# EAGLE design Drummer_Project (EAGLE 9.6.2)
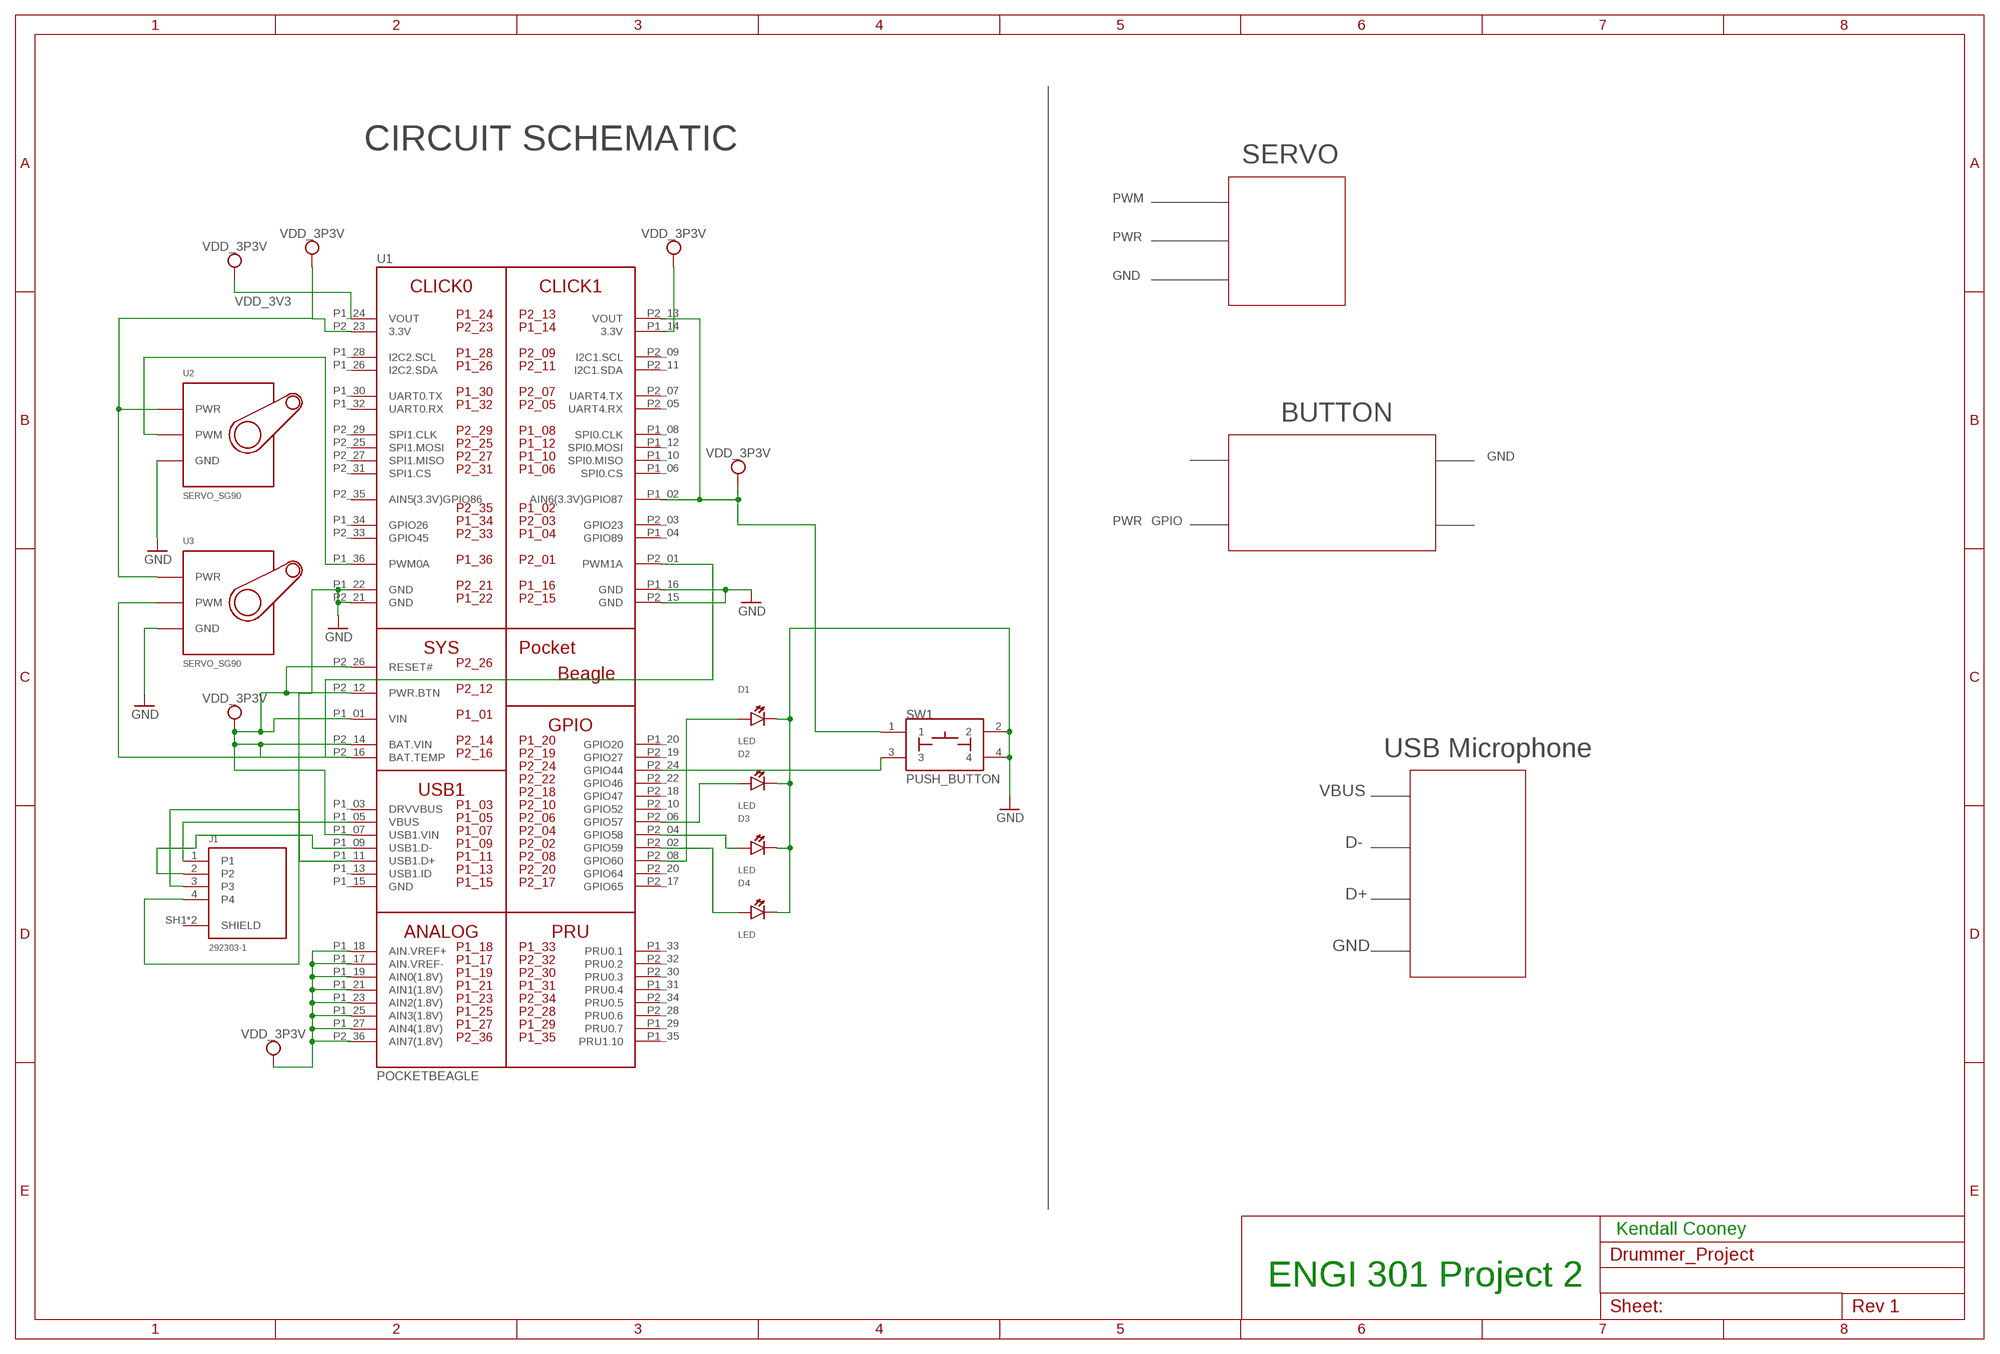
[diagram p0: schematic, sheet 1]

## Parts
D1  LED  [EIA-STD]
D2  LED  [EIA-STD]
D3  LED  [EIA-STD]
D4  LED  [EIA-STD]
J1  292303-1  [TE_292303-1]
SW1  PUSH_BUTTON  [BUTTON_12.5MM]
U1  POCKETBEAGLE  [POCKETBEAGLE]
U2  SERVO_SG90  [SERVO-X1]
U3  SERVO_SG90  [SERVO-X1]

## Nets
GND: D1.CATHODE D2.CATHODE D3.CATHODE D4.CATHODE J1.4 SW1.2 SW1.4 U1.P1_16(GND) U1.P1_22(GND) U1.P2_15(GND) U1.P2_21(GND) U2.GND U3.GND
N$1: SW1.3 U1.P2_24(GPIO44)
N$2: D4.ANODE U1.P2_02(GPIO59)
N$3: D3.ANODE U1.P2_04(GPIO58)
N$4: D1.ANODE U1.P2_08(GPIO60)
N$5: D2.ANODE U1.P2_06(GPIO57)
N$8: U1.P1_36(PWM0A) U2.SIG(PWM)
N$10: U1.P2_01(PWM1A) U3.SIG(PWM)
N$11: J1.1 U1.P1_05(VBUS)
N$12: J1.2 U1.P1_09(USB1.D-)
N$13: J1.3 U1.P1_11(USB1.D+)
VDD_3V3: SW1.1 U1.P1_01(VIN) U1.P1_02(AIN6(3.3V)GPIO87) U1.P1_07(USB1.VIN) U1.P1_14(3.3V) U1.P1_17(AIN.VREF-) U1.P1_18(AIN.VREF+) U1.P1_19(AIN0(1.8V)) U1.P1_21(AIN1(1.8V)) U1.P1_23(AIN2(1.8V)) U1.P1_24(VOUT) U1.P1_25(AIN3(1.8V)) U1.P1_27(AIN4(1.8V)) U1.P2_12(PWR.BTN) U1.P2_13(VOUT) U1.P2_14(BAT.VIN) U1.P2_16(BAT.TEMP) U1.P2_23(3.3V) U1.P2_26(RESET#) U1.P2_36(AIN7(1.8V)) U2.PWR U3.PWR ; supply symbol labelled VDD_3P3V
Unconnected: J1.SH1(SHIELD) J1.SH2(SHIELD) U1.P1_03(DRVVBUS) U1.P1_04(GPIO89) U1.P1_06(SPI0.CS) U1.P1_08(SPI0.CLK) U1.P1_10(SPI0.MISO) U1.P1_12(SPI0.MOSI) U1.P1_13(USB1.ID) U1.P1_15(GND) U1.P1_20(GPIO20) U1.P1_26(I2C2.SDA) U1.P1_28(I2C2.SCL) U1.P1_29(PRU0.7) U1.P1_30(UART0.TX) U1.P1_31(PRU0.4) U1.P1_32(UART0.RX) U1.P1_33(PRU0.1) U1.P1_34(GPIO26) U1.P1_35(PRU1.10) U1.P2_03(GPIO23) U1.P2_05(UART4.RX) U1.P2_07(UART4.TX) U1.P2_09(I2C1.SCL) U1.P2_10(GPIO52) U1.P2_11(I2C1.SDA) U1.P2_17(GPIO65) U1.P2_18(GPIO47) U1.P2_19(GPIO27) U1.P2_20(GPIO64) U1.P2_22(GPIO46) U1.P2_25(SPI1.MOSI) U1.P2_27(SPI1.MISO) U1.P2_28(PRU0.6) U1.P2_29(SPI1.CLK) U1.P2_30(PRU0.3) U1.P2_31(SPI1.CS) U1.P2_32(PRU0.2) U1.P2_33(GPIO45) U1.P2_34(PRU0.5) U1.P2_35(AIN5(3.3V)GPIO86)

## Notes on the sheet
- CIRCUIT SCHEMATIC
- SERVO
- PWM
- PWR
- GND
- BUTTON
- GND
- PWR | GPIO
- USB Microphone
- VBUS
- D-
- D+
- GND
- Kendall Cooney
- ENGI 301 Project 2

## Library data of the parts
D1-D4 = combo_lock:LED: EIA-STD LED, LTST-C191TBKT
J1 = 292303-1:292303-1: CONN USB RECEPT R/A TYPE A 4POS Check availability <https://pricing.snapeda.com/parts/292303-1/TE%20Connectivity/view-part?ref=eda>; AVAILABILITY: In Stock; COMMENT: 292303-1; DESCRIPTION: Conn; Data; USB; Recept; 2.0; 4 Pos; 1 Port; Rt Angle; A Ser; Tin over Copper; EU_ROHS_COMPLIANCE: Compliant; MF: TE Connectivity; MP: 292303-1; PACKAGE: None; PRICE: None; PURCHASE-URL: https://pricing.snapeda.com/search/part/292303-1/?ref=eda
SW1 = combo_lock:PUSH_BUTTON
U1 = combo_lock:POCKETBEAGLE
U2 U3 = combo_lock:SERVO_SG90

## Board
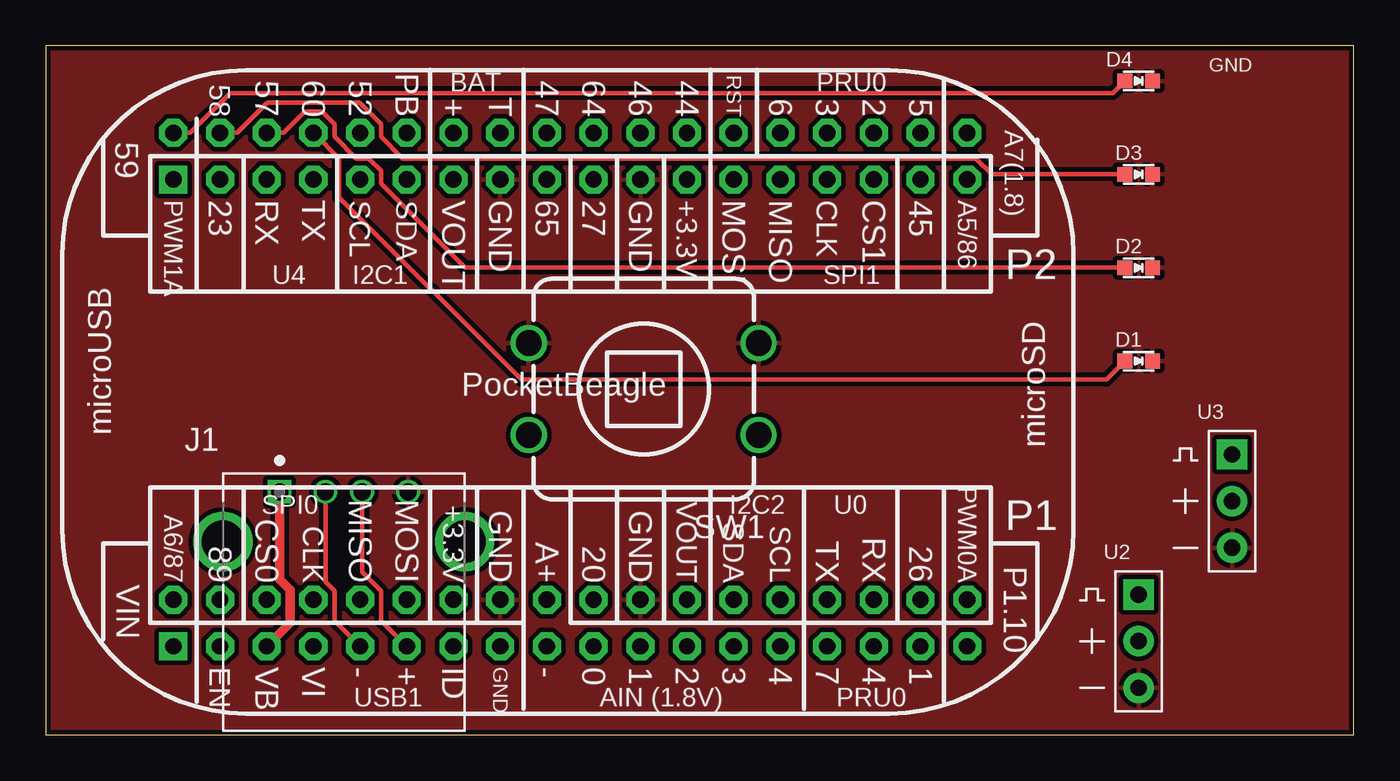
[diagram p1: board, top side]
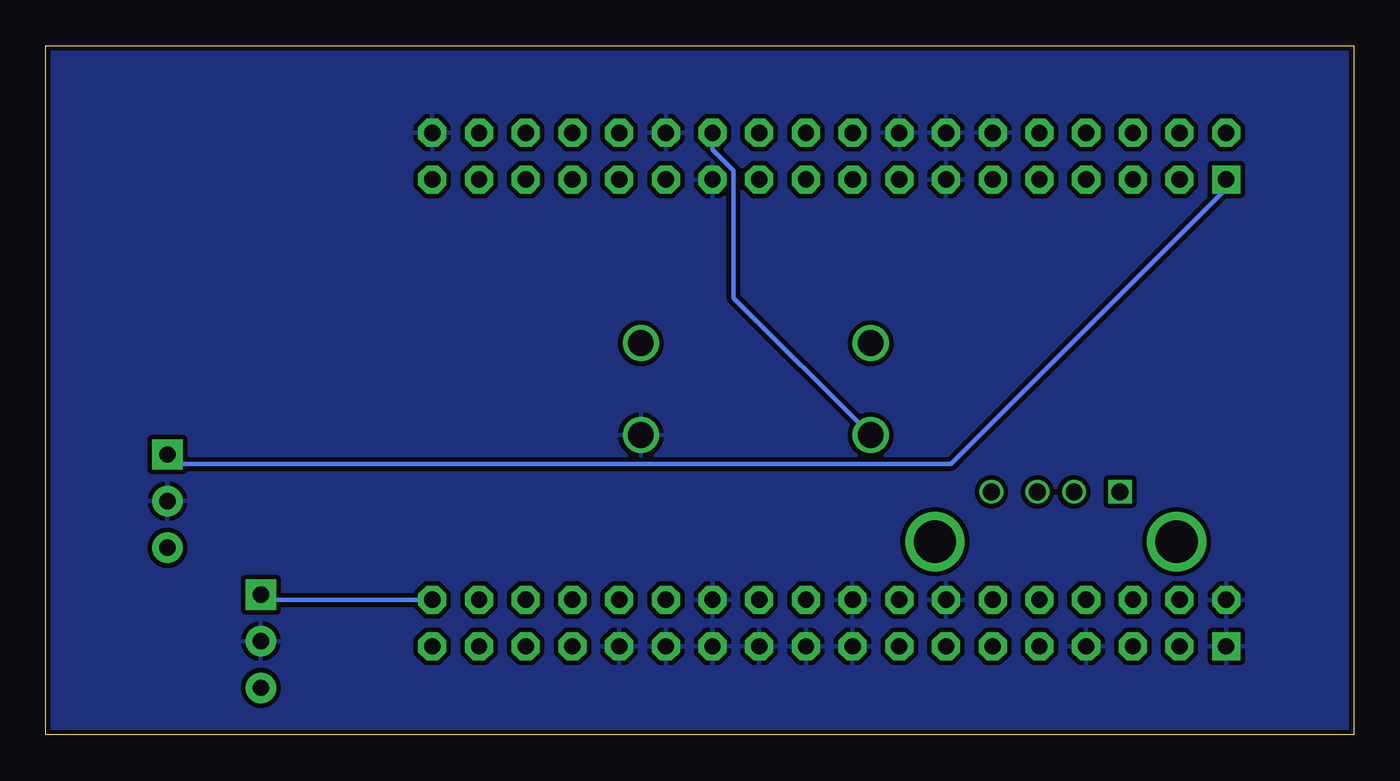
[diagram p2: board, bottom side, seen from below]

Size 71.12 x 37.47 mm. Coordinates in mm from the lower left corner, seen from the top.
Outline: 0,0 71.12,0 71.12,37.47 0,37.47 0,0
Copper layers (1*16): Top 0.035mm / dielectric 0.23mm / Bottom 0.035mm
Design rules "ENGI301_4lyr (1)": minimum track width 10mil, minimum drill 12mil, track to track 10mil, track to pad 10mil, pad to pad 10mil, via to via 10mil, smd to smd 10mil, copper to edge 10mil, drill to drill 12mil, minimum pad ring 6mil, minimum via ring 6mil, stop-mask expansion 3mil, vias tented up to drill 25mil, thermal gap 10mil

### Footprints (pad centres in the part's own frame; a part is rotated, then mirrored left to right if it is on the bottom)
EIA-STD = smd 0.8 x 0.8: ANODE -0.75,0; CATHODE 0.75,0
TE_292303-1 = drill 0.92 square: 1 0,0 | drill 0.92: 2 2.5,0; 3 4.5,0; 4 7,0 | drill 2.3: SH1 -3.07,-2.71; SH2 10.07,-2.71
BUTTON_12.5MM = drill 1.4: 1 -6.25,2.5; 2 -6.25,-2.5; 3 6.25,2.5; 4 6.25,-2.5
POCKETBEAGLE = drill 0.889 pad 1.524 square: P1_01 5.91,3.53; P2_01 5.91,28.93 | drill 0.889 pad 1.524 octagon: P1_02 5.91,6.07; P1_03 8.45,3.53; P1_04 8.45,6.07; P1_05 10.99,3.53; P1_06 10.99,6.07; P1_07 13.53,3.53; P1_08 13.53,6.07; P1_09 16.07,3.53; P1_10 16.07,6.07; P1_11 18.61,3.53; P1_12 18.61,6.07; P1_13 21.15,3.53; P1_14 21.15,6.07; P1_15 23.69,3.53; P1_16 23.69,6.07; P1_17 26.23,3.53; P1_18 26.23,6.07; P1_19 28.77,3.53; P1_20 28.77,6.07; P1_21 31.31,3.53; P1_22 31.31,6.07; P1_23 33.85,3.53; P1_24 33.85,6.07; P1_25 36.39,3.53; P1_26 36.39,6.07; P1_27 38.93,3.53; P1_28 38.93,6.07; P1_29 41.47,3.53; P1_30 41.47,6.07; P1_31 44.01,3.53; P1_32 44.01,6.07; P1_33 46.55,3.53; P1_34 46.55,6.07; P1_35 49.09,3.53; P1_36 49.09,6.07; P2_02 5.91,31.47; P2_03 8.45,28.93; P2_04 8.45,31.47; P2_05 10.99,28.93; P2_06 10.99,31.47; P2_07 13.53,28.93; P2_08 13.53,31.47; P2_09 16.07,28.93; P2_10 16.07,31.47; P2_11 18.61,28.93; P2_12 18.61,31.47; P2_13 21.15,28.93; P2_14 21.15,31.47; P2_15 23.69,28.93; P2_16 23.69,31.47; P2_17 26.23,28.93; P2_18 26.23,31.47; P2_19 28.77,28.93; P2_20 28.77,31.47; P2_21 31.31,28.93; P2_22 31.31,31.47; P2_23 33.85,28.93; P2_24 33.85,31.47; P2_25 36.39,28.93; P2_26 36.39,31.47; P2_27 38.93,28.93; P2_28 38.93,31.47; P2_29 41.47,28.93; P2_30 41.47,31.47; P2_31 44.01,28.93; P2_32 44.01,31.47; P2_33 46.55,28.93; P2_34 46.55,31.47; P2_35 49.09,28.93; P2_36 49.09,31.47
SERVO-X1 = drill 0.889 pad 1.651: GND 0,-2.54; PWR 0,0 | drill 0.889 pad 1.651 square: SIG 0,2.54

### Placement (x,y rotation side)
D1  59.44,20.32 0 top
D2  59.44,25.4 0 top
D3  59.44,30.48 0 top
D4  59.44,35.56 0 top
J1  12.7,13.21 0 top
SW1  32.51,18.8 180 top
U1  1.02,1.27 0 top
U2  59.44,5.08 0 top
U3  64.52,12.7 0 top

### Tracks (layer width: path | path; a pad name or v marks a point on that pad's centre or on a via)
GND
  pour Top: -2.54,40.64 -2.54,-2.54 73.66,-2.54 73.66,40.64
N$1
  Bottom 0.254: U1.P2_24 34.87,31.82 33.72,30.67 33.72,23.76 SW1.3
N$2
  Top 0.254: U1.P2_02 7.85,32.74 10.01,34.9 58.02,34.9 D4.ANODE
N$3
  Top 0.254: D3.ANODE 51.44,30.48 50.58,31.34 19.41,31.34 18.23,32.52 18.23,33.21 17.05,34.39 12.04,34.39 10.39,32.74 U1.P2_04
N$4
  Top 0.254: U1.P2_08 15.94,31.34 15.94,29.22 25.86,19.3 57.67,19.3 D1.ANODE
N$5
  Top 0.254: D2.ANODE 22.81,25.4 18.23,29.98 18.23,30.67 17.56,31.34 16.87,31.34 15.69,32.52 15.69,33.21 15.02,33.88 14.07,33.88 12.93,32.74 U1.P2_06
N$8
  Bottom 0.254: U2.SIG 59.16,7.34 U1.P1_36
N$10
  Bottom 0.254: U3.SIG 64.01,14.73 21.89,14.73 6.93,29.69 U1.P2_01
N$11
  Top 0.508: J1.1 12.7,8.44 13.28,7.87 13.28,6.07 U1.P1_05
N$12
  Top 0.254: J1.2 15.2,8.3 15.69,7.81 15.69,6.2 U1.P1_09
N$13
  Top 0.254: J1.3 17.2,8.84 18.23,7.81 18.23,6.2 U1.P1_11
VDD_3V3
  pour Bottom: -5.08,43.18 -5.08,-5.08 76.2,-5.08 76.2,43.18

### Text on the board
tNames: GND